# Altium schematic sheet EightADC_chnls.SchDoc
size A4
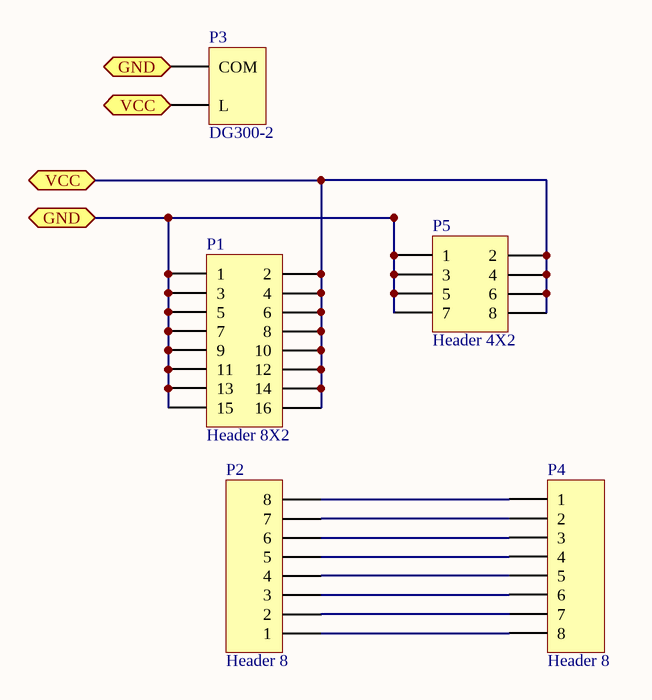
[diagram p0: EightADC_chnls.SchDoc]

## Parts
P1  Header 8X2  [HDR2X8]
P2  Header 8  [HDR1X8]
P3  DG300-2  [DG300-2]
P4  Header 8  [HDR1X8]
P5  Header 4X2  [HDR2X4]

## Ports
GND, VCC

## Nets
GND: P1.1 P1.3 P1.5 P1.7 P1.9 P1.11 P1.13 P1.15 P3.1(COM) P5.1 P5.3 P5.5 P5.7 ; port GND
VCC: P1.2 P1.4 P1.6 P1.8 P1.10 P1.12 P1.14 P1.16 P3.2(L) P5.2 P5.4 P5.6 P5.8 ; port VCC
NetP2_1: P2.1 P4.8
NetP2_2: P2.2 P4.7
NetP2_3: P2.3 P4.6
NetP2_4: P2.4 P4.5
NetP2_5: P2.5 P4.4
NetP2_6: P2.6 P4.3
NetP2_7: P2.7 P4.2
NetP2_8: P2.8 P4.1

## Library data of the parts
P1 = Header 8X2: Header, 8-Pin, Dual row; LatestRevisionDate: 17-Jul-2002; LatestRevisionNote: Re-released for DXP Platform.; Publisher: Altium Limited
P2 P4 = Header 8: Header, 8-Pin; LatestRevisionDate: 17-Jul-2002; LatestRevisionNote: Re-released for DXP Platform.; Publisher: Altium Limited
P3 = DG300-2: Blue contact claws
P5 = Header 4X2: Header, 4-Pin, Dual row; LatestRevisionDate: 17-Jul-2002; LatestRevisionNote: Re-released for DXP Platform.; Publisher: Altium Limited